# EAGLE design MRCS-ODX-8 (EAGLE 7.7.0)
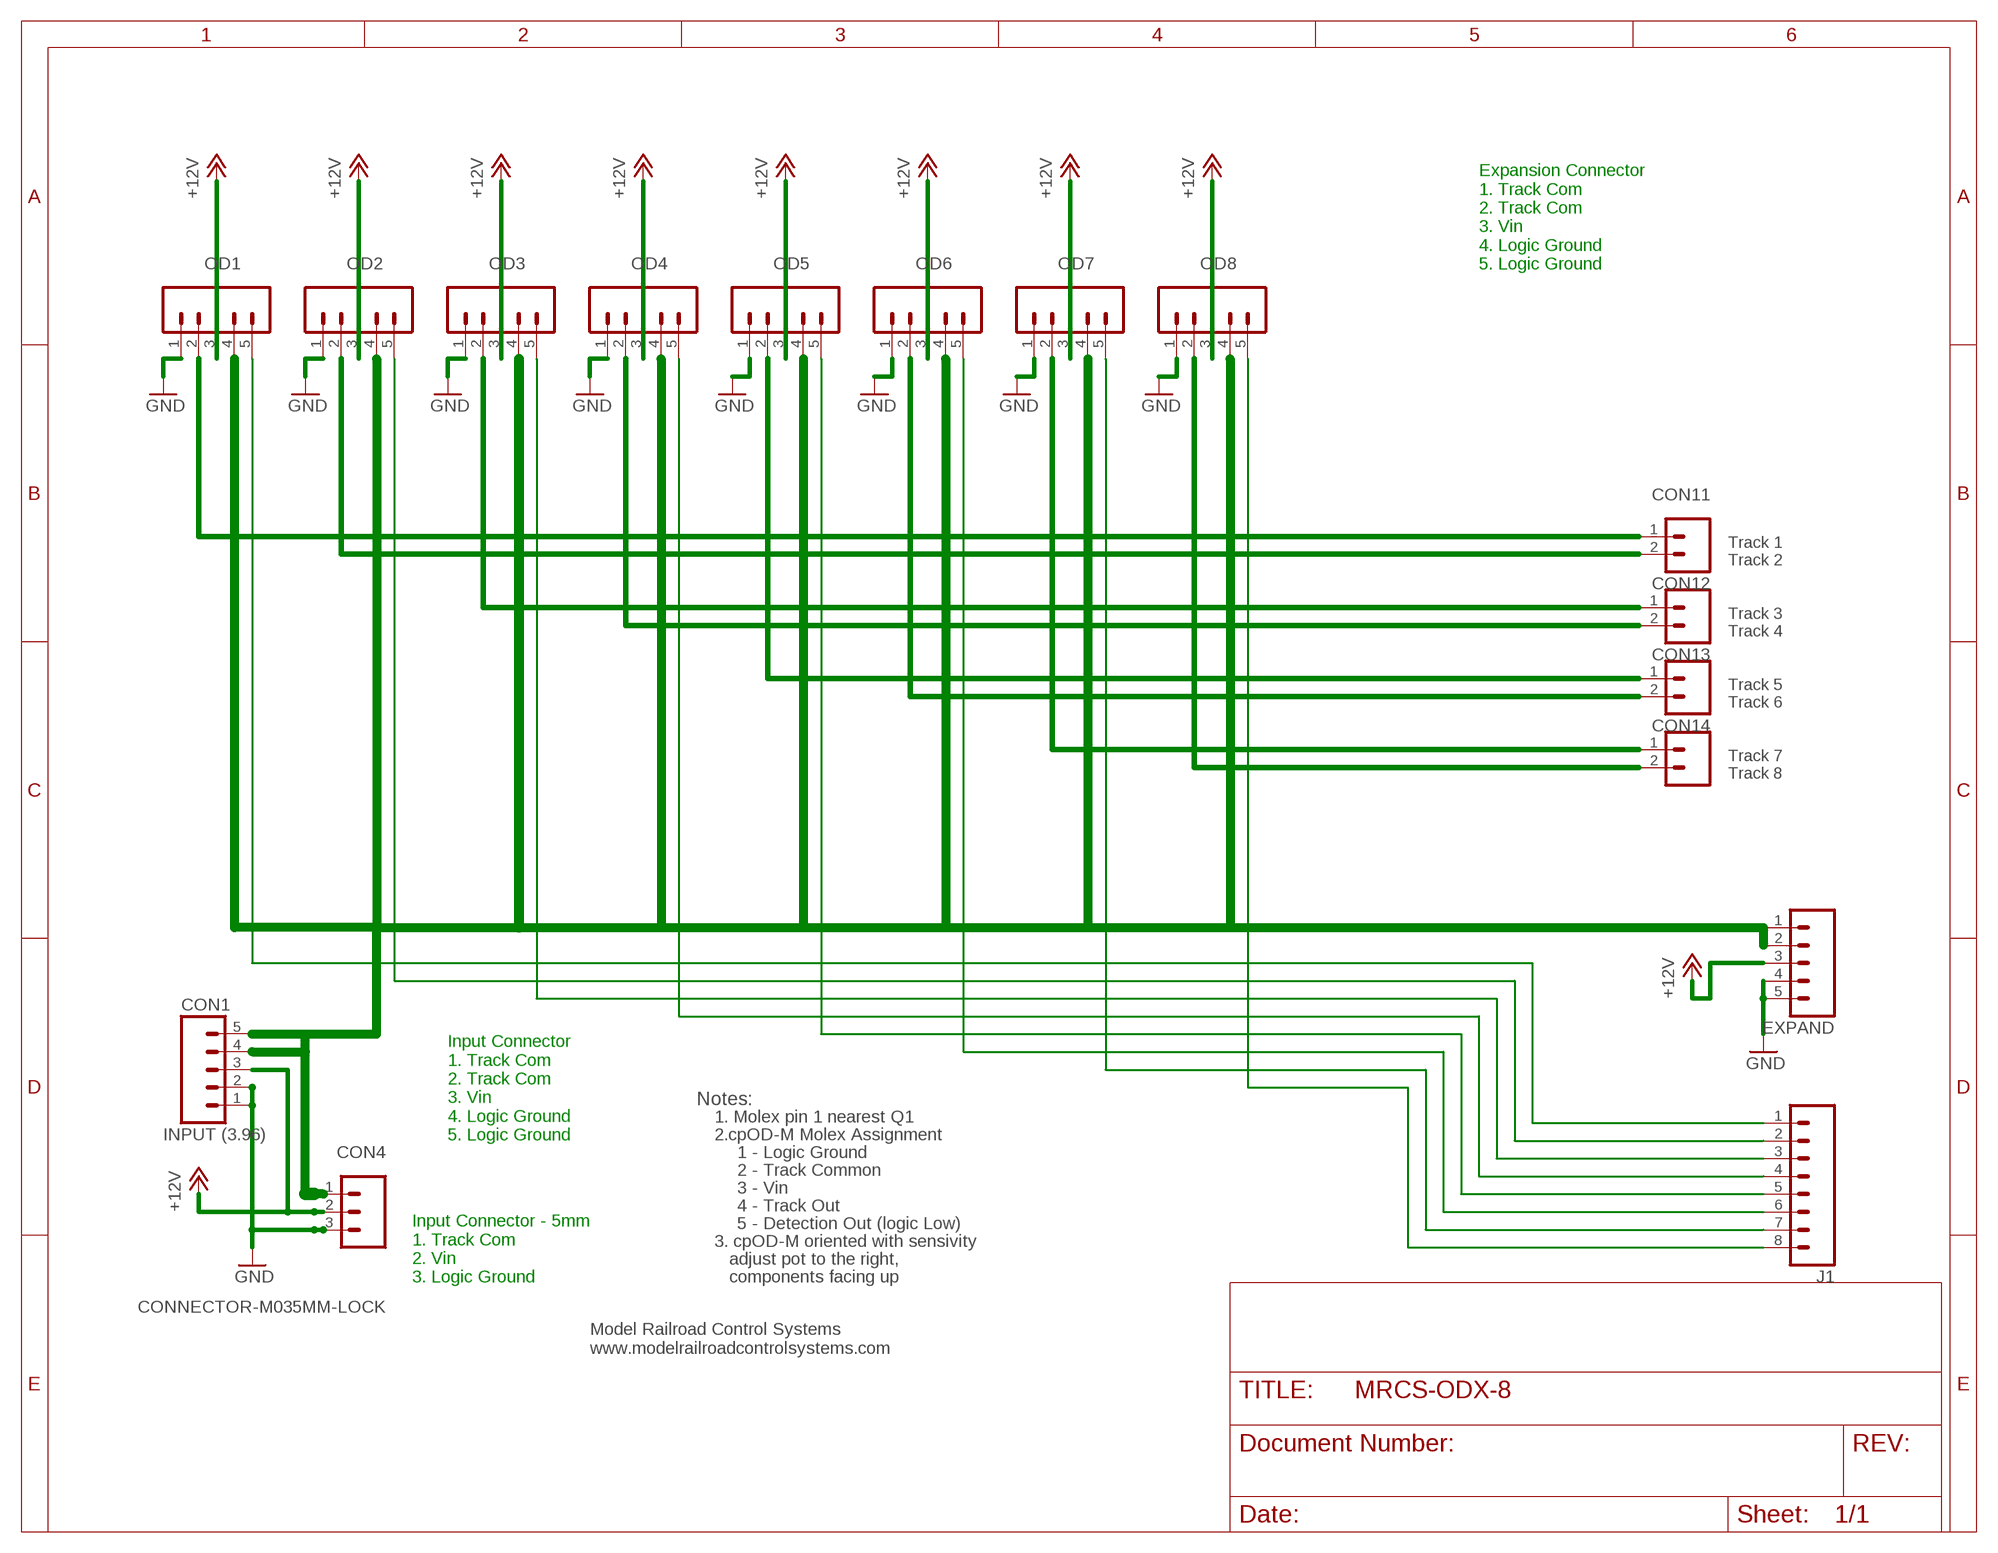
[diagram p0: schematic, sheet 1]

## Parts
CON1  INPUT (3.96)  CONNECTOR-M051.56  [KK-156-5]
CON4  CONNECTOR-M035MM-LOCK  [SCREWTERMINAL-5MM-3]
CON11  CONNECTOR-M025MM-LOCK  [SCREWTERMINAL-5MM-2]
CON12  CONNECTOR-M025MM-LOCK  [SCREWTERMINAL-5MM-2]
CON13  CONNECTOR-M025MM-LOCK  [SCREWTERMINAL-5MM-2]
CON14  CONNECTOR-M025MM-LOCK  [SCREWTERMINAL-5MM-2]
EXPAND  CONNECTOR-M051.56  [KK-156-5]
J1  CONNECTOR-M08LOCK  [1X08_LOCK]
OD1  CONNECTOR-M051.56  [KK-156-5]
OD2  CONNECTOR-M051.56  [KK-156-5]
OD3  CONNECTOR-M051.56  [KK-156-5]
OD4  CONNECTOR-M051.56  [KK-156-5]
OD5  CONNECTOR-M051.56  [KK-156-5]
OD6  CONNECTOR-M051.56  [KK-156-5]
OD7  CONNECTOR-M051.56  [KK-156-5]
OD8  CONNECTOR-M051.56  [KK-156-5]

## Nets
+12V: CON1.3 CON4.2 EXPAND.3 OD1.3 OD2.3 OD3.3 OD4.3 OD5.3 OD6.3 OD7.3 OD8.3
GND: CON1.1 CON1.2 CON4.3 EXPAND.4 EXPAND.5 OD1.1 OD2.1 OD3.1 OD4.1 OD5.1 OD6.1 OD7.1 OD8.1
N$1: CON14.2(B) OD8.2
N$3: CON11.1(A) OD1.2
N$5: CON13.2(B) OD6.2
N$6: CON13.1(A) OD5.2
N$10: J1.2 OD2.5
N$11: J1.1 OD1.5
N$13: J1.4 OD4.5
N$15: J1.5 OD5.5
N$16: J1.6 OD6.5
N$17: J1.8 OD8.5
N$18: J1.7 OD7.5
N$20: J1.3 OD3.5
N$25: CON14.1(A) OD7.2
N$26: CON12.2(B) OD4.2
N$27: CON12.1(A) OD3.2
N$28: CON11.2(B) OD2.2
TRACK_POWER: CON1.4 CON1.5 CON4.1 EXPAND.1 EXPAND.2 OD1.4 OD2.4 OD3.4 OD4.4 OD5.4 OD6.4 OD7.4 OD8.4

## Notes on the sheet
- Expansion Connector
  1. Track Com
  2. Track Com
  3. Vin
  4. Logic Ground
  5. Logic Ground
- Track 1
  Track 2
- Track 3
  Track 4
- Track 5
  Track 6
- Track 7
  Track 8
- Notes:
- 1. Molex pin 1 nearest Q1
- Input Connector
  1. Track Com
  2. Track Com
  3. Vin
  4. Logic Ground
  5. Logic Ground
- 2.cpOD-M Molex Assignment
- 1 - Logic Ground
- 2 - Track Common
- 3 - Vin
- 4 - Track Out
- 5 - Detection Out (logic Low)
- 3. cpOD-M oriented with sensivity
- adjust pot to the right,
- Input Connector - 5mm
  1. Track Com
  2. Vin
  3. Logic Ground
- components facing up
- Model Railroad Control Systems
  www.modelrailroadcontrolsystems.com

## Library data of the parts
CON1 EXPAND OD1-OD8 = SPCoast:CONNECTOR-M05: Header 5 Standard 5-pin 0.1" header. Use with straight break away headers (SKU : PRT-00116), right angle break away headers (PRT-00553), swiss pins (PRT-00743), machine pins (PRT-00117), and female headers (PRT-00115). Molex polarized connector foot print use with SKU : PRT-08230 with associated crimp pins and housings.
CON4 = SPCoast:CONNECTOR-M03
CON11-CON14 = SPCoast:CONNECTOR-M02: PHOENIX CONNECTOR
J1 = SPCoast:CONNECTOR-M08: Header 8 Standard 8-pin 0.1" header. Use with straight break away headers (SKU : PRT-00116), right angle break away headers (PRT-00553), swiss pins (PRT-00743), machine pins (PRT-00117), and female headers (PRT-00115).

## Board
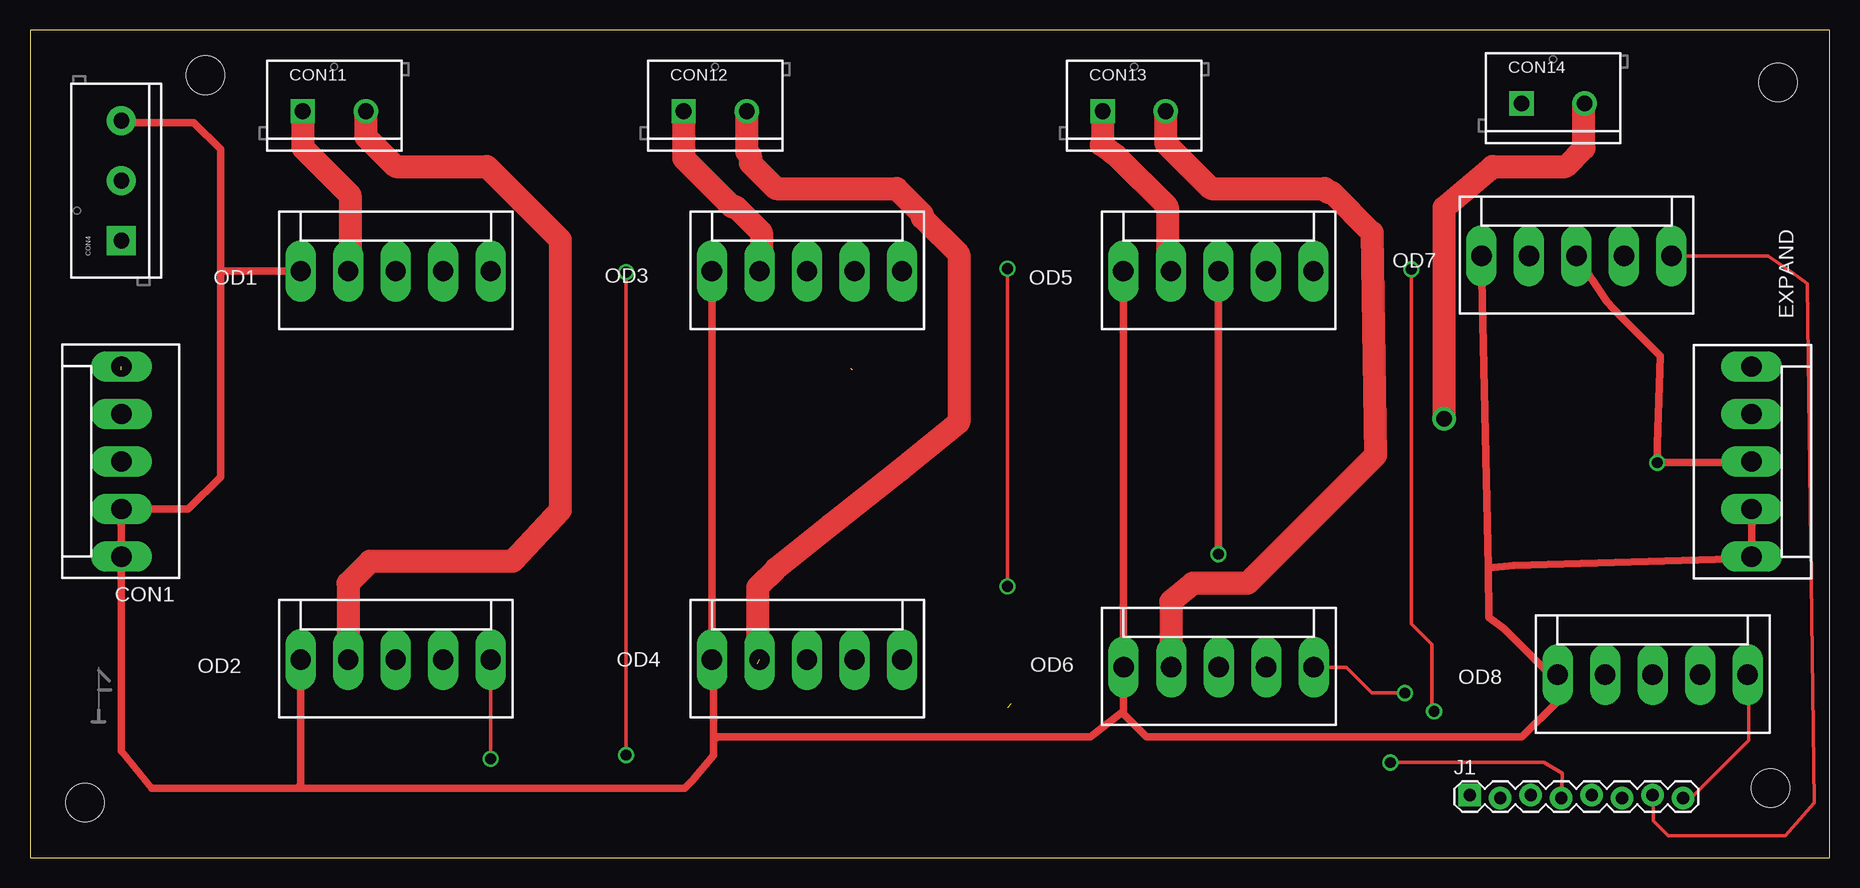
[diagram p1: board, top side]
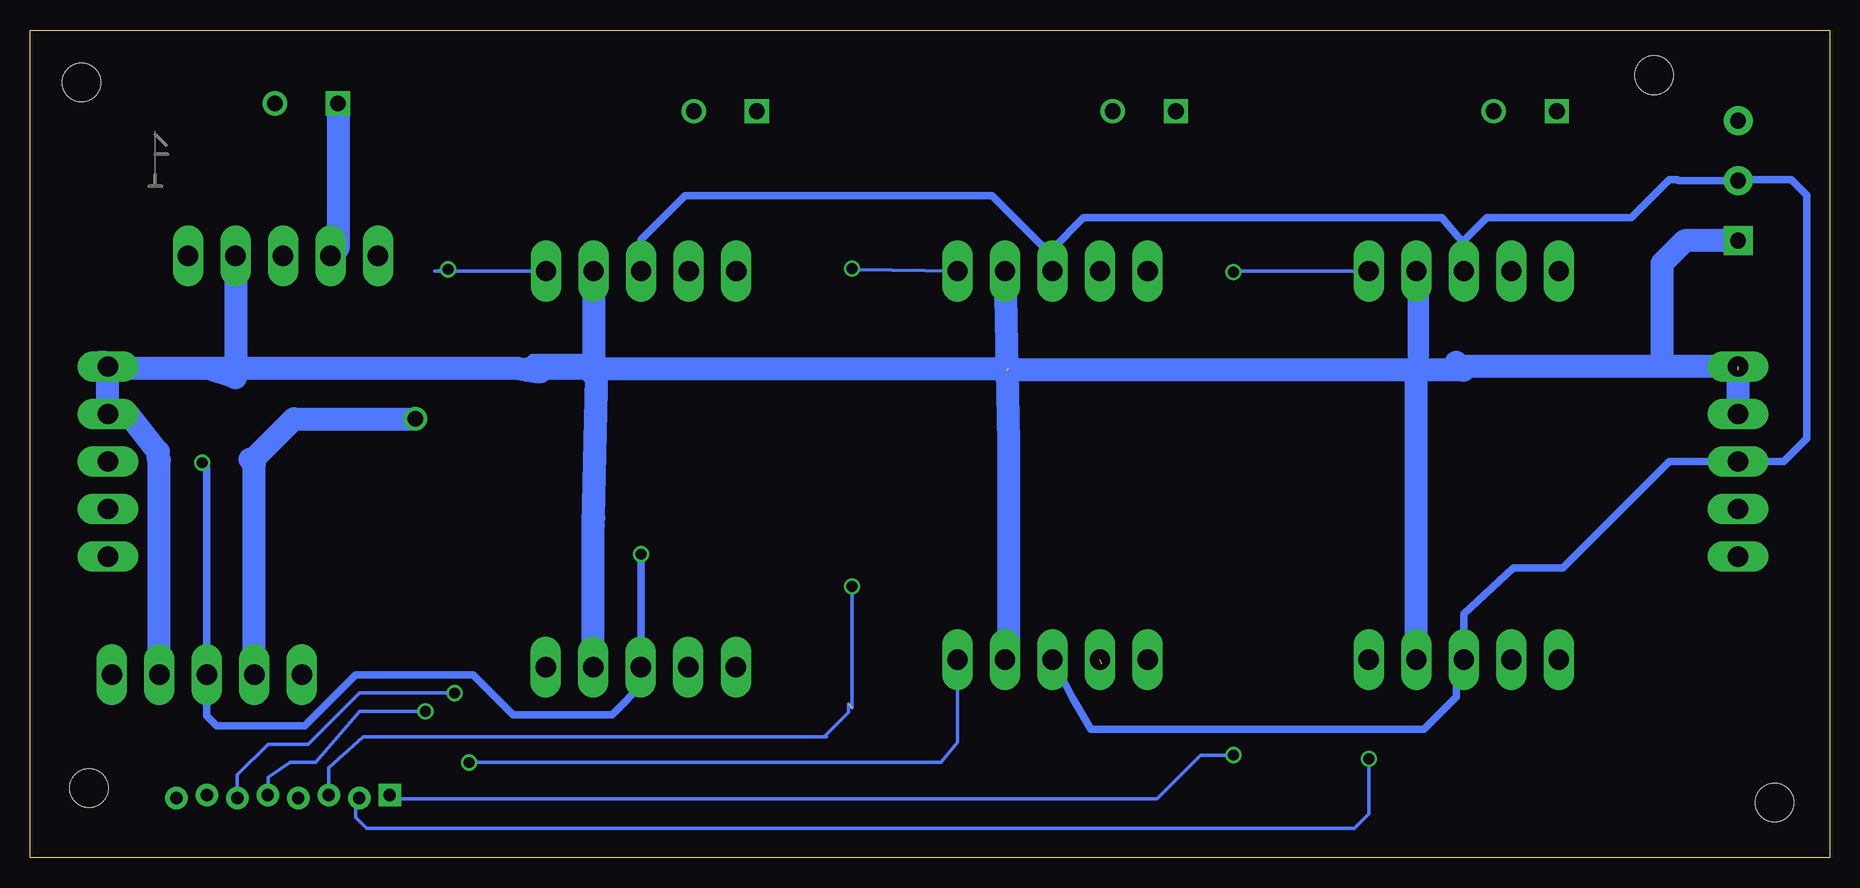
[diagram p2: board, bottom side, seen from below]

Size 150 x 69 mm. Coordinates in mm from the lower left corner, seen from the top.
Outline: 0,0 150,0 150,69 0,69 0,0
Copper layers (1*16): Top 0.035mm / dielectric 1.5mm / Bottom 0.035mm
Design rules "default": minimum track width 10mil, minimum drill 24mil, track to track 8mil, track to pad 8mil, pad to pad 8mil, via to via 8mil, smd to smd 8mil, copper to edge 40mil, drill to drill 8mil, minimum pad ring 10mil, minimum via ring 8mil, stop-mask expansion 4mil, vias tented up to drill 0mil, thermal gap 10mil
Holes 3.2 mm at 14.63,65.23 145.69,64.62 145.08,5.79 4.57,4.57

### Footprints (pad centres in the part's own frame; a part is rotated, then mirrored left to right if it is on the bottom)
KK-156-5 = drill 1.7 pad 2.184 long: 1 -7.92,0; 2 -3.96,0; 3 0,0; 4 3.96,0; 5 7.92,0
SCREWTERMINAL-5MM-3 = drill 1.3 pad 2.413 square: 1 0,0 | drill 1.3 pad 2.413: 2 5,0; 3 10,0
SCREWTERMINAL-5MM-2 = drill 1.3 pad 2.032 square: 1 -0.127,0 | drill 1.3 pad 2.032: 2 5.127,0
1X08_LOCK = drill 1.016 pad 1.88 square: 1 0,0.127 | drill 1.016 pad 1.88: 2 2.54,-0.127; 3 5.08,0.127; 4 7.62,-0.127; 5 10.16,0.127; 6 12.7,-0.127; 7 15.24,0.127; 8 17.78,-0.127

### Placement (x,y rotation side)
CON1  7.62,33.02 90 top
CON4  7.62,51.44 90 top
CON11  22.86,62.23 0 top
CON12  54.61,62.23 0 top
CON13  89.53,62.23 0 top
CON14  124.46,62.87 0 top
EXPAND  143.51,33.02 270 top
J1  120.02,5.08 0 top
OD1  30.48,48.9 0 top
OD2  30.48,16.51 0 top
OD3  64.77,48.9 0 top
OD4  64.77,16.51 0 top
OD5  99.06,48.9 0 top
OD6  99.09,15.88 0 top
OD7  128.91,50.16 0 top
OD8  135.25,15.24 0 top
U$1  [MRCSLOGOTOP]  4.45,10.79 0 top
U$2  [MRCSLOGOBTM]  133.2,55.47 0 top
U$3  [CA-PROP65WARNING]  63.4,39.32 0 top

### Tracks (layer width: path | path; a pad name or v marks a point on that pad's centre or on a via)
+12V  (via drill 0.9)
  Top 0.61: OD5.3 v99.06,25.3 | EXPAND.3 144.68,32.92 v135.64,32.92 135.64,34.44 135.89,41.81 132.61,45.09 131.44,46.35 OD7.3
  Bottom 0.61: CON4.2 8.26,56.44 | 8.26,56.44 12.62,56.44 12.7,56.52 13.34,56.52 16.51,53.34 28.57,53.34 30.48,51.44 30.48,51.21 | 30.48,51.21 OD1.3 | 8.26,56.44 8.18,56.52 3.17,56.52 1.91,55.24 1.91,34.92 3.81,33.02 CON1.3 13.34,33.02 22.23,24.13 26.36,24.13 30.48,20.32 30.48,17.14 31.11,16.51 | 31.11,16.51 OD2.3 | 31.11,16.51 31.11,13.39 33.83,10.67 61.57,10.67 63.09,13.31 OD4.3 | 30.48,51.21 32.31,53.34 62.18,53.34 64.77,50.75 OD3.3 65.05,50.42 69.8,55.17 95.4,55.17 99.06,51.51 OD5.3 | v99.06,25.3 99.06,16.51 OD6.3 98.75,15.54 98.75,14.63 101.5,11.89 109.73,11.89 113.08,15.24 122.83,15.24 127.1,10.97 134.42,10.97 135.25,11.81 OD8.3 135.25,32.54 v135.64,32.92
GND
  Top 0.61: 15.88,48.77 15.88,31.75 13.19,29.06 CON1.2 CON1.1 7.62,8.89 10.13,5.77 22.25,5.77 | 15.88,48.77 15.88,59.05 13.65,61.28 7.78,61.28 CON4.3 | 22.25,5.77 52.09,5.77 54.56,5.79 55.17,6.4 57,8.53 57,9.75 | OD1.1 16,48.9 15.88,48.77 | 57,9.75 57,16.36 OD4.1 OD3.1 | OD2.1 22.56,6.08 22.25,5.77 | 91.03,12.11 91.17,12.22 OD6.1 91.14,16.51 OD5.1 | 91.03,12.11 88.39,10.06 57.3,10.06 57,9.75 | OD8.1 127.33,14.61 | 127.33,14.61 127.33,13.04 124.36,10.06 93.08,10.06 91.03,12.11 | EXPAND.4 EXPAND.5 144.67,24.99 123.68,24.36 121.55,24.14 | OD7.1 121.55,24.14 | 121.55,24.14 121.62,20.04 122.89,19.05 127.33,14.61
N$1  (via drill 1.3)
  Top 1.93: v117.88,36.58 117.88,54.2 121.92,57.61 128.02,57.61 129.54,59.13 129.54,62.82 CON14.2
  Bottom 1.93: OD8.2 131.29,32.84 131.67,33.22 131.37,33.22 128.02,36.58 v117.88,36.58
N$3
  Top 1.93: CON11.1 22.73,59.18 26.67,55.24 26.67,49.05 OD1.2
N$5
  Top 1.93: CON13.2 94.66,59.57 98.45,55.78 107.9,55.78 108.2,55.47 108.51,55.47 111.86,52.12 112.17,33.53 101.5,22.86 96.93,22.86 95.1,21.34 95.1,16.21 OD6.2
N$6
  Top 1.93: CON13.1 89.41,59.94 89.31,59.44 90.53,58.52 94.79,54.25 94.79,49.2 OD5.2
N$10  (via drill 0.9)
  Top 0.305: OD2.5 v38.4,8.23
  Top 0.61: v38.4,8.23 v38.41,8.23
  Bottom 0.305: v38.41,8.23 38.41,3.66 39.62,2.44 121.92,2.44 122.83,3.35 122.83,4.67 J1.2
N$11  (via drill 0.9)
  Top 0.305: v49.68,48.82 v49.68,8.53
  Bottom 0.305: v49.68,8.53 52.43,8.53 56.08,4.88 119.69,4.88 J1.1 | OD1.5 49.61,48.9 v49.68,48.82
N$13  (via drill 0.9)
  Top 0.305: v113.39,7.92 126.19,7.92 127.71,7.01 J1.4
  Bottom 0.305: OD4.5 72.69,9.61 74.07,7.92 v113.39,7.92
N$15  (via drill 0.9)
  Top 0.305: v115.14,49.05 115.14,19.48 116.84,17.78 116.84,12.39 v117.04,12.19
  Bottom 0.305: OD5.5 116.26,48.9 v115.14,49.05 | v117.04,12.19 122.53,12.19 126.19,7.92 128.32,7.92 130.15,6.71 130.15,5.23 J1.5
N$16  (via drill 0.9)
  Top 0.305: v114.61,13.72 111.86,13.72 109.73,15.85 107.03,15.85 OD6.5
  Bottom 0.305: J1.6 132.72,6.88 130.15,9.45 126.8,9.45 122.53,13.72 v114.61,13.72
N$17
  Top 0.305: J1.8 138.46,4.95 143.26,9.75 143.26,15.16 OD8.5
N$18
  Top 0.305: OD7.5 144.88,50.16 146.91,48.77 148.13,47.85 148.74,4.57 146.3,1.83 136.55,1.83 135.33,3.05 135.33,5.13 J1.7
N$20  (via drill 0.9)  (1 unrouted)
  Top 0.305: v81.48,49.1 v81.48,22.61
  Bottom 0.305: 83.62,10.06 83.82,10.06 | 83.82,10.06 122.22,10.06 125.09,7.49 J1.3 | OD3.5 80.94,49 v81.48,49.1 | v81.48,22.61 81.48,12.5 | 81.79,12.83 81.79,12.09 83.82,10.06
N$25
  Bottom 1.93: CON14.1 124.33,50.78 OD7.2
N$26  (1 unrouted)
  Top 1.93: CON12.2 59.74,58.83 60.05,58.52 60.05,57.91 62.18,55.78 72.24,55.78 74.37,53.65 74.37,53.34 77.42,50.29 77.42,36.27 72.54,32.31 66.75,27.74 62.18,24.08 60.66,22.55 60.66,16.15
N$27
  Top 1.93: CON12.1 54.48,58.29 58.52,54.25 58.83,54.25 60.96,52.12 60.96,49.05 OD3.2
N$28
  Top 1.93: CON11.2 27.99,60.1 30.48,57.61 38.1,57.61 44.2,51.51 44.2,28.96 40.23,24.69 28.35,24.69 26.52,22.86 OD2.2
TRACK_POWER  (2 unrouted)
  Bottom 0.406: 34.29,41.91 34.29,40.64 | 103.02,41.76 108.21,41.76 109.2,40.77 73.66,40.77
  Bottom 1.778: 34.29,48.74 34.29,41.91
  Bottom 1.93: CON1.5 13.34,40.94 | 13.34,40.94 30.18,40.94 30.48,40.64 | 30.48,40.64 31.11,41.27 | 34.29,48.74 OD1.4 | CON4.1 12.06,51.44 13.97,49.53 13.97,41.58 13.34,40.94 | 68.89,16.66 OD4.4 68.42,16.82 68.42,34.59 68.55,40.64 | OD3.4 68.55,40.64 | 103.02,28.34 102.74,40.77 | 102.74,40.77 73.66,40.77 68.45,40.77 | OD6.4 103.05,27.71 102.76,39.99 | 102.76,39.99 102.74,40.77 | OD8.4 139.22,33.15 139.29,33.22 139.29,33.83 141.73,36.88 144.07,36.88 EXPAND.2 EXPAND.1 143.84,41.27 144.15,41.27 143.66,40.79 135.25,40.79 | 135.25,40.79 109.37,40.79 109.2,40.77 107.47,40.49 | CON1.4 7.62,40.64 | 30.48,40.64 34.29,40.64 | 34.29,40.64 68.55,40.64 | OD2.4 34.44,40.49 34.29,40.64 | 103.41,40.64 102.76,39.99 | OD5.4 103.02,41.76 | 102.74,40.77 108.46,40.77 108.58,40.64 | OD7.4 132.87,40.01 135.25,40.79

### Text on the board
tDocu: Track 7 / Track 8 | Track 1 / Track 2 | Track 3 / Track 4 | Track 5 / Track 6 | GND / Vin / COM | cpOD Pins / 1. Logic Ground / 2. Track Out / 3. Vin / 4. Track Com / 5. Detection Out | Expansion Pins / 1. Track Com / 2. Track Com / 3. Vin / 4. Logic Ground / 5. Logic Ground | ODX-8 cpOD Motherboard / Seth Neumann 20210417 | Detection Output 1 | 8
bDocu: Control Point Occupancy Detector Motherboard / ODX-8 Seth Neumann / 20210405